# EAGLE design shrg-001 (EAGLE 9.6.2)
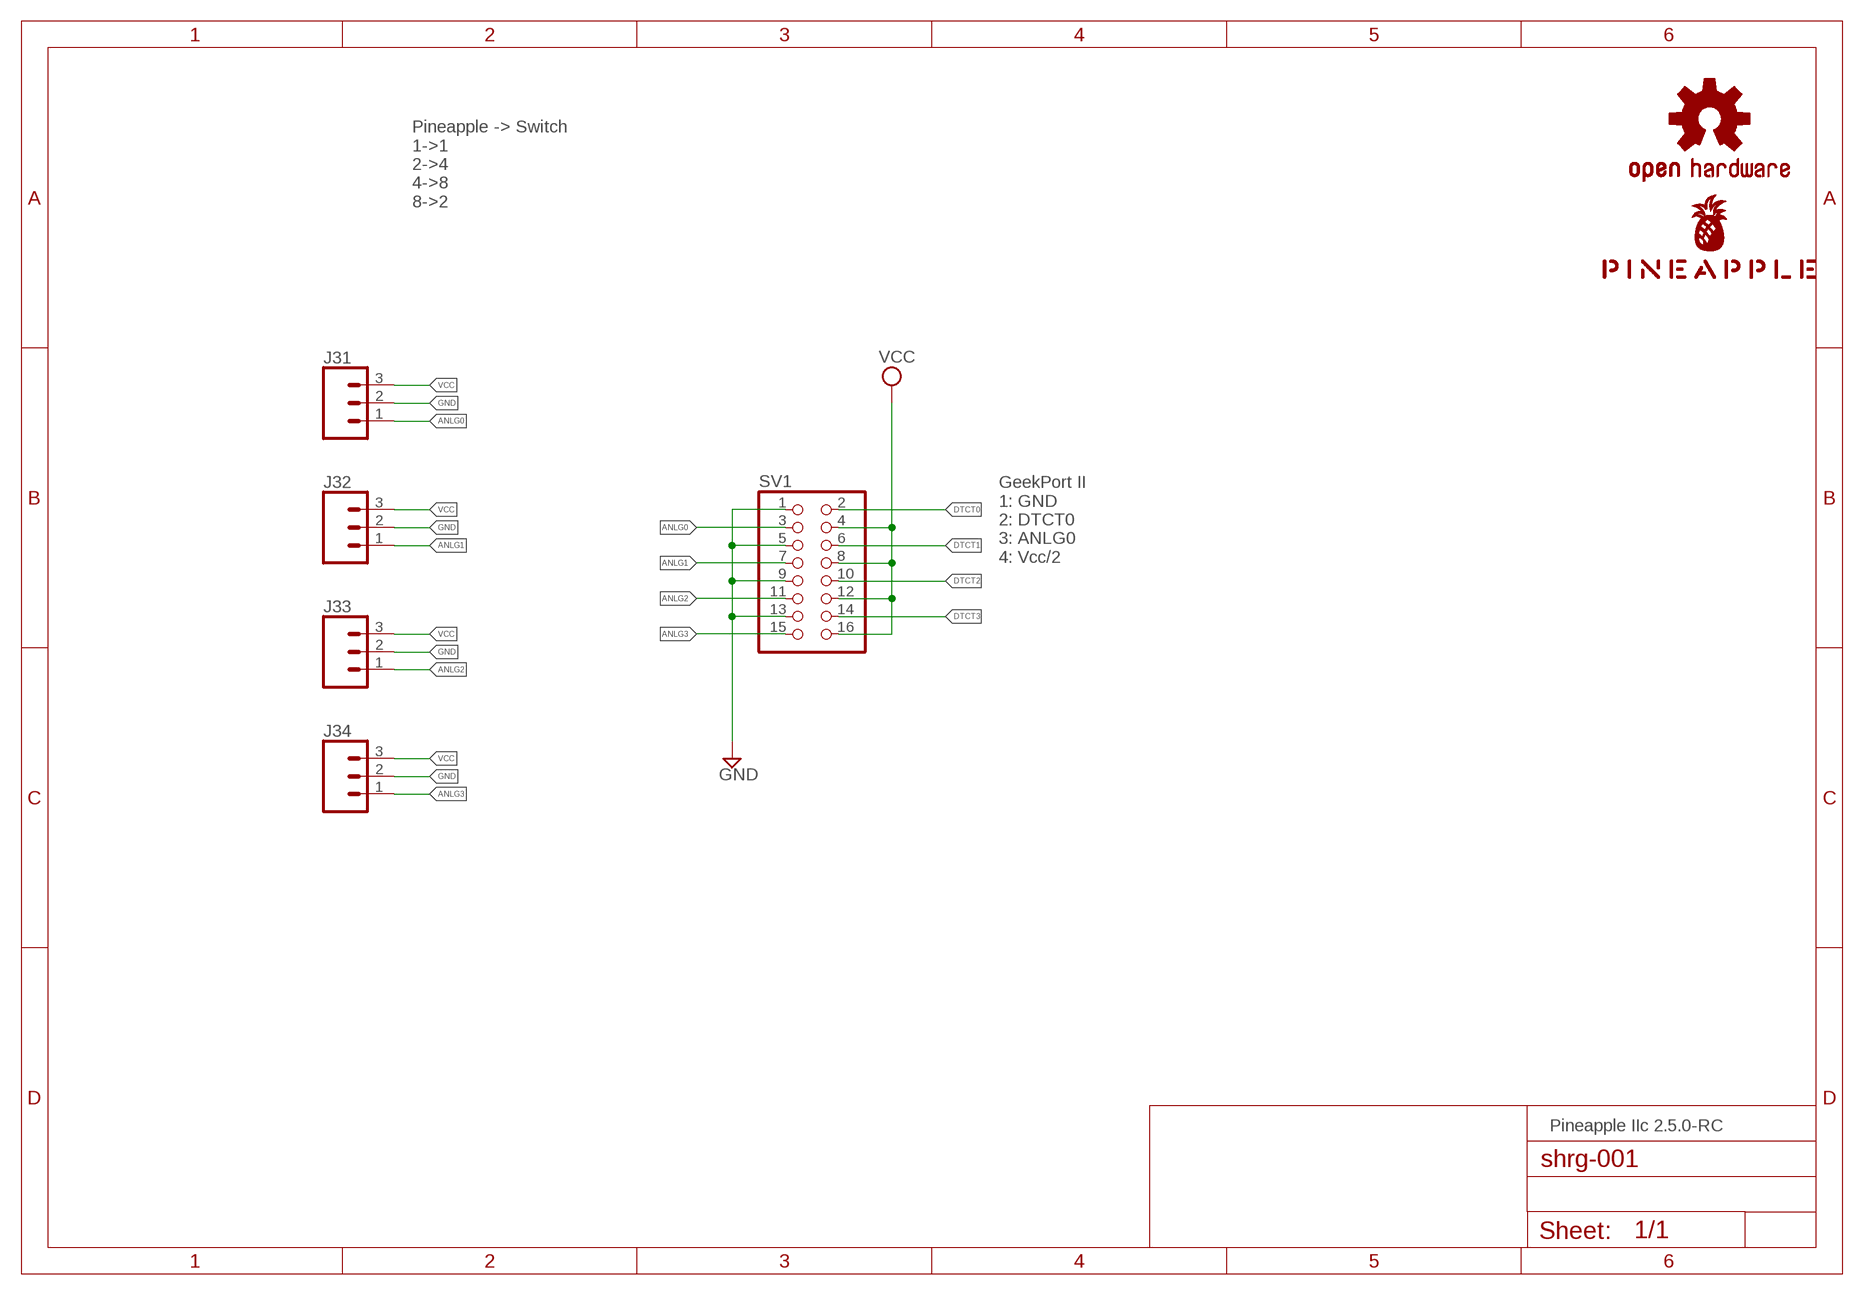
[diagram p0: schematic, sheet 1]

## Parts
J31  CONN_03JST-PTH-VERT  [JST-3-PTH-VERT]
J32  CONN_03JST-PTH-VERT  [JST-3-PTH-VERT]
J33  CONN_03JST-PTH-VERT  [JST-3-PTH-VERT]
J34  CONN_03JST-PTH-VERT  [JST-3-PTH-VERT]
LOGO1  OSHW-LOGOS-COPPER  [OSHW-LOGO-S_COPPER]
SV1  PINHD-2X8  [2X08]
U$1  PINEAPPLE450_SILK  [PINEAPPLE450_SILK]

## Nets
ANLG0: J31.1 SV1.3
ANLG1: J32.1 SV1.7
ANLG2: J33.1 SV1.11
ANLG3: J34.1 SV1.15
DTCT0: SV1.2
DTCT1: SV1.6
DTCT2: SV1.10
DTCT3: SV1.14
GND: J31.2 J32.2 J33.2 J34.2 SV1.1 SV1.5 SV1.9 SV1.13
VCC: J31.3 J32.3 J33.3 J34.3 SV1.4 SV1.8 SV1.12 SV1.16

## Notes on the sheet
- Pineapple -> Switch
  1->1
  2->4
  4->8
  8->2
- GeekPort II
  1: GND
  2: DTCT0
  3: ANLG0
  4: Vcc/2
- Pineapple IIc 2.5.0-RC

## Library data of the parts
J31-J34 = SparkFun-Connectors:CONN_03: Multi connection point. Often used as Generic Header-pin footprint for 0.1 inch spaced/style header connections On any of the 0.1 inch spaced packages, you can populate with these: Break Away Headers - Straight <https://www.sparkfun.com/products/116> (PRT-00116) Break Away Male Headers - Right Angle <https://www.sparkfun.com/products/553> (PRT-00553) Female Headers <https://www.sparkfun.com/products/115> (PRT-00115) Break Away Headers - Machine Pin <https://www.sparkfun.com/products/117> (PRT-00117) Break Away Female Headers - Swiss Machine Pin <https://www.sparkfun.com/products/743> (PRT-00743) Stackable Header - 3 Pin (Female, 0.1") <https://www.sparkfun.com/products/13875> (PRT-13875) For SCREWTERMINALS and SPRING TERMINALS visit here: Screw Terimnals on SparkFun.com <https://www.sparkfun.com/search/results?term=Screw+Terminals> (5mm/3.5mm/2.54mm spacing) This device is also useful as a general connection point to wire up your design to another part of your project. Our various solder wires solder well into these plated through hole pads. Hook-Up Wire - Assortment (Stranded, 22 AWG) <https://www.sparkfun.com/products/11375> (PRT-11375) Hook-Up Wire - Assortment (Solid Core, 22 AWG) <https://www.sparkfun.com/products/11367> (PRT-11367) View the entire wire category on our website here <https://www.sparkfun.com/categories/141> Special notes: Molex polarized connector foot print use with SKU : PRT-08232 with associated crimp pins and housings.; PROD_ID: CONN-13230
LOGO1 = SparkFun-Aesthetics:OSHW-LOGO: Open-Source Hardware (OSHW) Logo This logo indicates the piece of hardware it is found on incorporates a OSHW license and/or adheres to the definition of open source hardware found here: http://freedomdefined.org/OSHW
SV1 = pinhead:PINHD-2X8: PIN HEADER
U$1 = pineapple:PINEAPPLE450_SILK

## Net classes
0 default: width 0.152 mm, drill 0.152 mm, clearance 0.152 mm
1 ground: width 0.305 mm, drill 0.152 mm, clearance 0.152 mm
2 power1: width 0.508 mm, drill 0.152 mm, clearance 0.152 mm
3 power2: width 0.61 mm, drill 0.152 mm, clearance 0.152 mm
4 analog: width 0.305 mm, drill 0.152 mm, clearance 0.152 mm
5 external: width 0.152 mm, drill 0.152 mm, clearance 0.152 mm

## Board
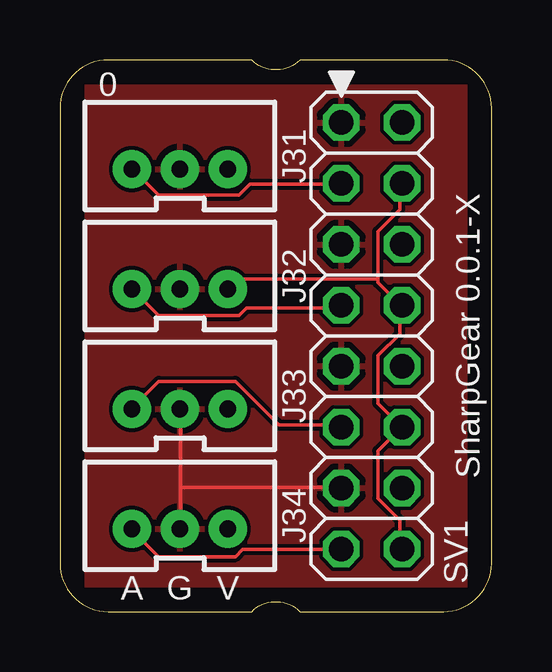
[diagram p1: board, top side]
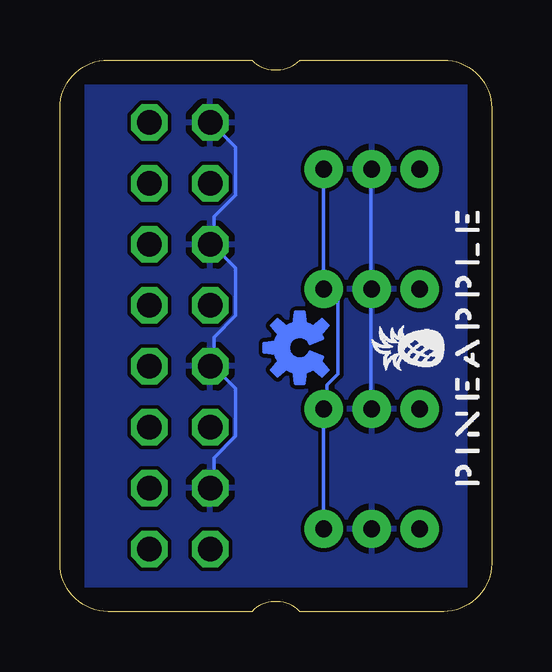
[diagram p2: board, bottom side, seen from below]

Size 18 x 23 mm. Coordinates in mm from the lower left corner, seen from the top.
Outline: 0,21 0,2 arc90 2,0 8,0 arc-90 10,0 16,0 arc90 18,2 18,21 arc90 16,23 10,23 arc-90 8,23 2,23 arc90 0,21
Copper layers (1*16): Top 0.035mm / dielectric 1.5mm / Bottom 0.035mm
Design rules "SeeedStudio_2layer_DRU_no_angle_20140221": minimum track width 6mil, minimum drill 12mil, track to track 6mil, track to pad 6mil, pad to pad 6mil, via to via 6mil, smd to smd 0mil, copper to edge 10mil, drill to drill 10mil, minimum pad ring 10mil, minimum via ring 6mil, stop-mask expansion 2mil, vias tented up to drill 100mil, thermal gap 10mil
tRestrict: area 0,0 to 1,23; area 0,22 to 18,23; area 17,0 to 18,23; area 0,0 to 18,1
bRestrict: area 0,0 to 18,1; area 17,0 to 18,23; area 0,22 to 18,23; area 0,0 to 1,23

### Footprints (pad centres in the part's own frame; a part is rotated, then mirrored left to right if it is on the bottom)
JST-3-PTH-VERT = drill 0.7 pad 1.6: 1 -2,-0.55; 2 0,-0.55; 3 2,-0.55
2X08 = drill 1.016 octagon: 1 -8.89,-1.27; 2 -8.89,1.27; 3 -6.35,-1.27; 4 -6.35,1.27; 5 -3.81,-1.27; 6 -3.81,1.27; 7 -1.27,-1.27; 8 -1.27,1.27; 9 1.27,-1.27; 10 1.27,1.27; 11 3.81,-1.27; 12 3.81,1.27; 13 6.35,-1.27; 14 6.35,1.27; 15 8.89,-1.27; 16 8.89,1.27

### Placement (x,y rotation side)
J31  5,19 0 top
J32  5,14 0 top
J33  5,9 0 top
J34  5,4 0 top
LOGO1  8,11 90 bottom
SV1  13,11.5 270 top
U$1  0.5,11 90 bottom

### Tracks (layer width: path | path; a pad name or v marks a point on that pad's centre or on a via)
ANLG0
  Top 0.152: SV1.3 11.58,17.83 7.92,17.83 7.47,17.37 4.12,17.37 3.05,18.44 J31.1
ANLG1
  Top 0.152: SV1.7 11.58,12.65 7.77,12.65 7.47,12.34 4.12,12.34 3.05,13.41 J32.1
ANLG2
  Top 0.152: SV1.11 11.58,7.77 9.14,7.77 7.32,9.6 4.12,9.6 3.05,8.53 J33.1
ANLG3
  Top 0.152: SV1.15 11.58,2.59 7.62,2.59 7.32,2.29 4.12,2.29 3.05,3.35 J34.1
GND
  Top 0.152: 5.03,5.18 5.03,8.38 J33.2 | 5.03,5.18 5.03,3.5 J34.2 | 5.03,5.18 11.58,5.18 SV1.13
  Bottom 0.152: SV1.13 11.58,5.18 11.58,6.4 10.67,7.32 10.67,9.3 11.58,10.21 SV1.9 11.58,10.36 11.58,11.43 10.67,12.34 10.67,14.33 11.58,15.24 SV1.5 11.58,15.39 11.58,16.46 10.67,17.37 10.67,19.36 11.58,20.27 SV1.1 | J31.2 5.03,18.44 5.03,13.56 J32.2 5.03,13.41 5.03,8.53 J33.2
  pour Top: -1,-1 19,-1 19,24 -1,24
  pour Bottom: -2,-2 20,-2 20,25 -2,25
VCC
  Top 0.152: SV1.16 14.17,2.74 14.17,3.81 13.26,4.72 13.26,6.71 14.17,7.62 SV1.12 14.17,7.77 13.26,8.69 13.26,10.67 14.17,11.58 14.17,12.65 SV1.8 14.17,12.8 13.26,13.72 13.26,13.87 | 13.26,13.87 13.26,15.85 14.17,16.76 14.17,17.83 SV1.4 | 13.26,13.87 7.32,13.87 7.01,13.56 J32.3
  Bottom 0.152: J34.3 7.01,3.5 7.01,8.38 J33.3 6.86,8.53 6.86,9.45 6.4,9.91 6.4,12.95 6.86,13.41 J32.3 7.01,13.56 J31.3

### Text on the board
tNames: 0 | SharpGear 0.0.1-X | A | G | V